# Altium project sommotor.PrjPcb (part 2 of 2)

## Sheet 3 - Motor Drivers.SchDoc
size Tabloid
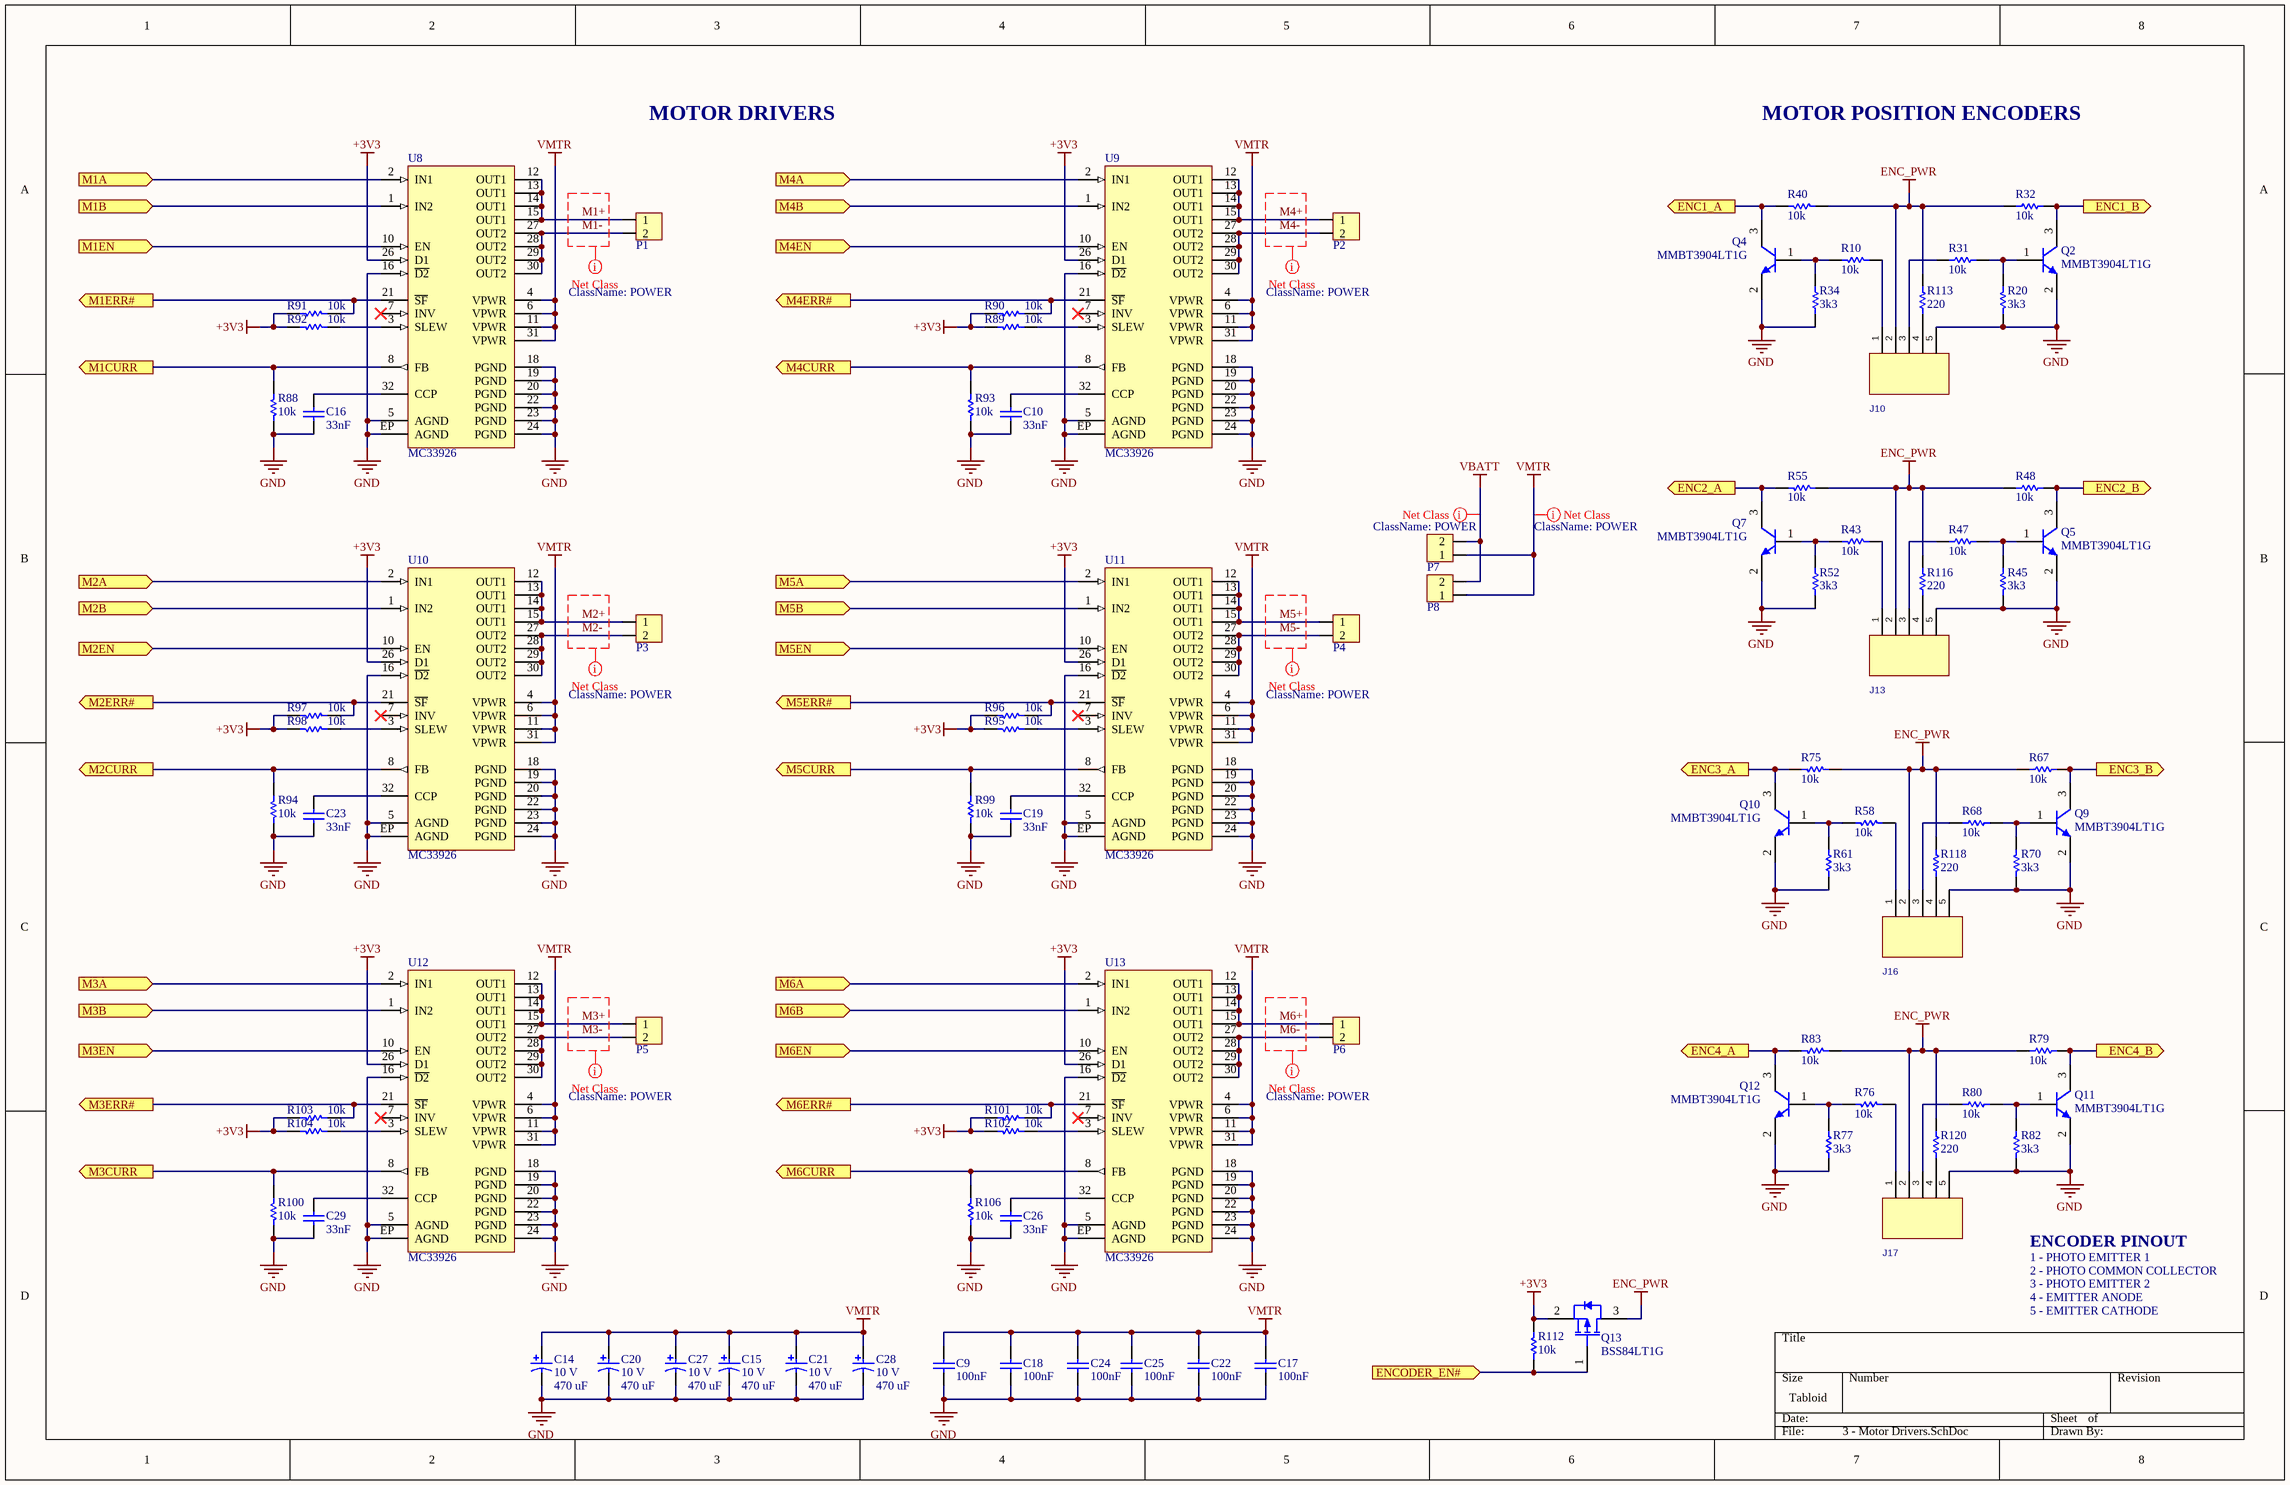
[diagram p3: 3 - Motor Drivers.SchDoc]

### Parts
C9  value 100nF  [CAPC0805(2012)100_L]  (hidden comment: CAP 100nF 6.3V 0805(2012))
C10  value 33nF  [CAPC0805(2012)100_L]  (hidden comment: CAP 33nF 50V 0805(2012))
C14  Rated Voltage: 10 V  Rated Capacitance: 470 uF  [NIC-CAPA2-8X10_V]  (hidden comment: UUD1A471MNL1GS)
C15  Rated Voltage: 10 V  Rated Capacitance: 470 uF  [NIC-CAPA2-8X10_V]  (hidden comment: UUD1A471MNL1GS)
C16  value 33nF  [CAPC0805(2012)100_L]  (hidden comment: CAP 33nF 50V 0805(2012))
C17  value 100nF  [CAPC0805(2012)100_L]  (hidden comment: CAP 100nF 6.3V 0805(2012))
C18  value 100nF  [CAPC0805(2012)100_L]  (hidden comment: CAP 100nF 6.3V 0805(2012))
C19  value 33nF  [CAPC0805(2012)100_L]  (hidden comment: CAP 33nF 50V 0805(2012))
C20  Rated Voltage: 10 V  Rated Capacitance: 470 uF  [NIC-CAPA2-8X10_V]  (hidden comment: UUD1A471MNL1GS)
C21  Rated Voltage: 10 V  Rated Capacitance: 470 uF  [NIC-CAPA2-8X10_V]  (hidden comment: UUD1A471MNL1GS)
C22  value 100nF  [CAPC0805(2012)100_L]  (hidden comment: CAP 100nF 6.3V 0805(2012))
C23  value 33nF  [CAPC0805(2012)100_L]  (hidden comment: CAP 33nF 50V 0805(2012))
C24  value 100nF  [CAPC0805(2012)100_L]  (hidden comment: CAP 100nF 6.3V 0805(2012))
C25  value 100nF  [CAPC0805(2012)100_L]  (hidden comment: CAP 100nF 6.3V 0805(2012))
C26  value 33nF  [CAPC0805(2012)100_L]  (hidden comment: CAP 33nF 50V 0805(2012))
C27  Rated Voltage: 10 V  Rated Capacitance: 470 uF  [NIC-CAPA2-8X10_V]  (hidden comment: UUD1A471MNL1GS)
C28  Rated Voltage: 10 V  Rated Capacitance: 470 uF  [NIC-CAPA2-8X10_V]  (hidden comment: UUD1A471MNL1GS)
C29  value 33nF  [CAPC0805(2012)100_L]  (hidden comment: CAP 33nF 50V 0805(2012))
J10  DF13-5P-1.25DS(20)  [HRS_DF13-5P-1.25DS(20)]  (value not drawn)
J13  DF13-5P-1.25DS(20)  [HRS_DF13-5P-1.25DS(20)]  (value not drawn)
J16  DF13-5P-1.25DS(20)  [HRS_DF13-5P-1.25DS(20)]  (value not drawn)
J17  DF13-5P-1.25DS(20)  [HRS_DF13-5P-1.25DS(20)]  (value not drawn)
P1  HDR1x2_2.54  [HDR1X2_2.54_180]  (value not drawn)
P2  HDR1x2_2.54  [HDR1X2_2.54_180]  (value not drawn)
P3  HDR1x2_2.54  [HDR1X2_2.54_180]  (value not drawn)
P4  HDR1x2_2.54  [HDR1X2_2.54_180]  (value not drawn)
P5  HDR1x2_2.54  [HDR1X2_2.54_180]  (value not drawn)
P6  HDR1x2_2.54  [HDR1X2_2.54_180]  (value not drawn)
P7  HDR1x2_2.54  [HDR1X2_2.54_180]  (value not drawn)
P8  HDR1x2_2.54  [HDR1X2_2.54_180]  (value not drawn)
Q2  MMBT3904LT1G  [ONSC-SOT-23-3-318-08_V]
Q4  MMBT3904LT1G  [ONSC-SOT-23-3-318-08_V]
Q5  MMBT3904LT1G  [ONSC-SOT-23-3-318-08_V]
Q7  MMBT3904LT1G  [ONSC-SOT-23-3-318-08_V]
Q9  MMBT3904LT1G  [ONSC-SOT-23-3-318-08_V]
Q10  MMBT3904LT1G  [ONSC-SOT-23-3-318-08_V]
Q11  MMBT3904LT1G  [ONSC-SOT-23-3-318-08_V]
Q12  MMBT3904LT1G  [ONSC-SOT-23-3-318-08_V]
Q13  BSS84LT1G  [ONSC-SOT-23-3-318-08_V]
R10  value 10k  [RESC0805(2012)_L]  (hidden comment: 10K 1% 0805(2012))
R20  value 3k3  [RESC0805(2012)_L]  (hidden comment: 3K3 1% 0805(2012))
R31  value 10k  [RESC0805(2012)_L]  (hidden comment: 10K 1% 0805(2012))
R32  value 10k  [RESC0805(2012)_L]  (hidden comment: 10K 1% 0805(2012))
R34  value 3k3  [RESC0805(2012)_L]  (hidden comment: 3K3 1% 0805(2012))
R40  value 10k  [RESC0805(2012)_L]  (hidden comment: 10K 1% 0805(2012))
R43  value 10k  [RESC0805(2012)_L]  (hidden comment: 10K 1% 0805(2012))
R45  value 3k3  [RESC0805(2012)_L]  (hidden comment: 3K3 1% 0805(2012))
R47  value 10k  [RESC0805(2012)_L]  (hidden comment: 10K 1% 0805(2012))
R48  value 10k  [RESC0805(2012)_L]  (hidden comment: 10K 1% 0805(2012))
R52  value 3k3  [RESC0805(2012)_L]  (hidden comment: 3K3 1% 0805(2012))
R55  value 10k  [RESC0805(2012)_L]  (hidden comment: 10K 1% 0805(2012))
R58  value 10k  [RESC0805(2012)_L]  (hidden comment: 10K 1% 0805(2012))
R61  value 3k3  [RESC0805(2012)_L]  (hidden comment: 3K3 1% 0805(2012))
R67  value 10k  [RESC0805(2012)_L]  (hidden comment: 10K 1% 0805(2012))
R68  value 10k  [RESC0805(2012)_L]  (hidden comment: 10K 1% 0805(2012))
R70  value 3k3  [RESC0805(2012)_L]  (hidden comment: 3K3 1% 0805(2012))
R75  value 10k  [RESC0805(2012)_L]  (hidden comment: 10K 1% 0805(2012))
R76  value 10k  [RESC0805(2012)_L]  (hidden comment: 10K 1% 0805(2012))
R77  value 3k3  [RESC0805(2012)_L]  (hidden comment: 3K3 1% 0805(2012))
R79  value 10k  [RESC0805(2012)_L]  (hidden comment: 10K 1% 0805(2012))
R80  value 10k  [RESC0805(2012)_L]  (hidden comment: 10K 1% 0805(2012))
R82  value 3k3  [RESC0805(2012)_L]  (hidden comment: 3K3 1% 0805(2012))
R83  value 10k  [RESC0805(2012)_L]  (hidden comment: 10K 1% 0805(2012))
R88  value 10k  [RESC0805(2012)_L]  (hidden comment: 10K 1% 0805(2012))
R89  value 10k  [RESC0805(2012)_L]  (hidden comment: 10K 1% 0805(2012))
R90  value 10k  [RESC0805(2012)_L]  (hidden comment: 10K 1% 0805(2012))
R91  value 10k  [RESC0805(2012)_L]  (hidden comment: 10K 1% 0805(2012))
R92  value 10k  [RESC0805(2012)_L]  (hidden comment: 10K 1% 0805(2012))
R93  value 10k  [RESC0805(2012)_L]  (hidden comment: 10K 1% 0805(2012))
R94  value 10k  [RESC0805(2012)_L]  (hidden comment: 10K 1% 0805(2012))
R95  value 10k  [RESC0805(2012)_L]  (hidden comment: 10K 1% 0805(2012))
R96  value 10k  [RESC0805(2012)_L]  (hidden comment: 10K 1% 0805(2012))
R97  value 10k  [RESC0805(2012)_L]  (hidden comment: 10K 1% 0805(2012))
R98  value 10k  [RESC0805(2012)_L]  (hidden comment: 10K 1% 0805(2012))
R99  value 10k  [RESC0805(2012)_L]  (hidden comment: 10K 1% 0805(2012))
R100  value 10k  [RESC0805(2012)_L]  (hidden comment: 10K 1% 0805(2012))
R101  value 10k  [RESC0805(2012)_L]  (hidden comment: 10K 1% 0805(2012))
R102  value 10k  [RESC0805(2012)_L]  (hidden comment: 10K 1% 0805(2012))
R103  value 10k  [RESC0805(2012)_L]  (hidden comment: 10K 1% 0805(2012))
R104  value 10k  [RESC0805(2012)_L]  (hidden comment: 10K 1% 0805(2012))
R106  value 10k  [RESC0805(2012)_L]  (hidden comment: 10K 1% 0805(2012))
R112  value 10k  [RESC0805(2012)_L]  (hidden comment: 10K 1% 0805(2012))
R113  value 220  [RESC0805(2012)_L]  (hidden comment: 220R 1% 0805(2012))
R116  value 220  [RESC0805(2012)_L]  (hidden comment: 220R 1% 0805(2012))
R118  value 220  [RESC0805(2012)_L]  (hidden comment: 220R 1% 0805(2012))
R120  value 220  [RESC0805(2012)_L]  (hidden comment: 220R 1% 0805(2012))
U8  MC33926  [FREESCALE_32PQFN]
U9  MC33926  [FREESCALE_32PQFN]
U10  MC33926  [FREESCALE_32PQFN]
U11  MC33926  [FREESCALE_32PQFN]
U12  MC33926  [FREESCALE_32PQFN]
U13  MC33926  [FREESCALE_32PQFN]

### Ports
ENC1_A (out), ENC1_B (out), ENC2_A (out), ENC2_B (out), ENC3_A (out), ENC3_B (out), ENC4_A (out), ENC4_B (out), ENCODER_EN# (in), M1A (in), M1B (in), M1CURR (out), M1EN (in), M1ERR# (out), M2A (in), M2B (in), M2CURR (out), M2EN (in), M2ERR# (out), M3A (in), M3B (in), M3CURR (out), M3EN (in), M3ERR# (out), M4A (in), M4B (in), M4CURR (out), M4EN (in), M4ERR# (out), M5A (in), M5B (in), M5CURR (out), M5EN (in), M5ERR# (out), M6A (in), M6B (in), M6CURR (out), M6EN (in), M6ERR# (out)

### Nets
+3V3: Q13.2(S) R89.2 R90.2 R91.2 R92.2 R95.2 R96.2 R97.2 R98.2 R101.2 R102.2 R103.2 R104.2 R112.1 U8.26(D1) U9.26(D1) U10.26(D1) U11.26(D1) U12.26(D1) U13.26(D1)
ENC_PWR: J10.2 J13.2 J16.2 J17.2 Q13.3(D) R32.1 R40.2 R48.1 R55.2 R67.1 R75.2 R79.1 R83.2 R113.2 R116.2 R118.2 R120.2
GND: C9.1 C10.1 C14.2 C15.2 C16.1 C17.1 C18.1 C19.1 C20.2 C21.2 C22.1 C23.1 C24.1 C25.1 C26.1 C27.2 C28.2 C29.1 J10.5 J13.5 J16.5 J17.5 Q2.2(E) Q4.2(E) Q5.2(E) Q7.2(E) Q9.2(E) Q10.2(E) Q11.2(E) Q12.2(E) R20.2 R34.2 R45.2 R52.2 R61.2 R70.2 R77.2 R82.2 R88.1 R93.1 R94.1 R99.1 R100.1 R106.1 U8.5(AGND) U8.16(~{D2}) U8.18(PGND) U8.19(PGND) U8.20(PGND) U8.22(PGND) U8.23(PGND) U8.24(PGND) U8.EP(AGND) U9.5(AGND) U9.16(~{D2}) U9.18(PGND) U9.19(PGND) U9.20(PGND) U9.22(PGND) U9.23(PGND) U9.24(PGND) U9.EP(AGND) U10.5(AGND) U10.16(~{D2}) U10.18(PGND) U10.19(PGND) U10.20(PGND) U10.22(PGND) U10.23(PGND) U10.24(PGND) U10.EP(AGND) U11.5(AGND) U11.16(~{D2}) U11.18(PGND) U11.19(PGND) U11.20(PGND) U11.22(PGND) U11.23(PGND) U11.24(PGND) U11.EP(AGND) U12.5(AGND) U12.16(~{D2}) U12.18(PGND) U12.19(PGND) U12.20(PGND) U12.22(PGND) U12.23(PGND) U12.24(PGND) U12.EP(AGND) U13.5(AGND) U13.16(~{D2}) U13.18(PGND) U13.19(PGND) U13.20(PGND) U13.22(PGND) U13.23(PGND) U13.24(PGND) U13.EP(AGND)
VBATT: P7.2 P8.2
VMTR: C9.2 C14.1 C15.1 C17.2 C18.2 C20.1 C21.1 C22.2 C24.2 C25.2 C27.1 C28.1 P7.1 P8.1 U8.4(VPWR) U8.6(VPWR) U8.11(VPWR) U8.31(VPWR) U9.4(VPWR) U9.6(VPWR) U9.11(VPWR) U9.31(VPWR) U10.4(VPWR) U10.6(VPWR) U10.11(VPWR) U10.31(VPWR) U11.4(VPWR) U11.6(VPWR) U11.11(VPWR) U11.31(VPWR) U12.4(VPWR) U12.6(VPWR) U12.11(VPWR) U12.31(VPWR) U13.4(VPWR) U13.6(VPWR) U13.11(VPWR) U13.31(VPWR)
M1+: P1.1 U8.12(OUT1) U8.13(OUT1) U8.14(OUT1) U8.15(OUT1)
M1-: P1.2 U8.27(OUT2) U8.28(OUT2) U8.29(OUT2) U8.30(OUT2)
M2+: P3.1 U10.12(OUT1) U10.13(OUT1) U10.14(OUT1) U10.15(OUT1)
M2-: P3.2 U10.27(OUT2) U10.28(OUT2) U10.29(OUT2) U10.30(OUT2)
M3+: P5.1 U12.12(OUT1) U12.13(OUT1) U12.14(OUT1) U12.15(OUT1)
M3-: P5.2 U12.27(OUT2) U12.28(OUT2) U12.29(OUT2) U12.30(OUT2)
M4+: P2.1 U9.12(OUT1) U9.13(OUT1) U9.14(OUT1) U9.15(OUT1)
M4-: P2.2 U9.27(OUT2) U9.28(OUT2) U9.29(OUT2) U9.30(OUT2)
M5+: P4.1 U11.12(OUT1) U11.13(OUT1) U11.14(OUT1) U11.15(OUT1)
M5-: P4.2 U11.27(OUT2) U11.28(OUT2) U11.29(OUT2) U11.30(OUT2)
M6+: P6.1 U13.12(OUT1) U13.13(OUT1) U13.14(OUT1) U13.15(OUT1)
M6-: P6.2 U13.27(OUT2) U13.28(OUT2) U13.29(OUT2) U13.30(OUT2)
NetC10_2: C10.2 U9.32(CCP)
NetC16_2: C16.2 U8.32(CCP)
NetC19_2: C19.2 U11.32(CCP)
NetC23_2: C23.2 U10.32(CCP)
NetC26_2: C26.2 U13.32(CCP)
NetC29_2: C29.2 U12.32(CCP)
NetJ10_1: J10.1 R10.1
NetJ10_3: J10.3 R31.1
NetJ10_4: J10.4 R113.1
NetJ13_1: J13.1 R43.1
NetJ13_3: J13.3 R47.1
NetJ13_4: J13.4 R116.1
NetJ16_1: J16.1 R58.1
NetJ16_3: J16.3 R68.1
NetJ16_4: J16.4 R118.1
NetJ17_1: J17.1 R76.1
NetJ17_3: J17.3 R80.1
NetJ17_4: J17.4 R120.1
NetQ2_1: Q2.1(B) R20.1 R31.2
NetQ2_3: Q2.3(C) R32.2 ; port ENC1_B
NetQ4_1: Q4.1(B) R10.2 R34.1
NetQ4_3: Q4.3(C) R40.1 ; port ENC1_A
NetQ5_1: Q5.1(B) R45.1 R47.2
NetQ5_3: Q5.3(C) R48.2 ; port ENC2_B
NetQ7_1: Q7.1(B) R43.2 R52.1
NetQ7_3: Q7.3(C) R55.1 ; port ENC2_A
NetQ9_1: Q9.1(B) R68.2 R70.1
NetQ9_3: Q9.3(C) R67.2 ; port ENC3_B
NetQ10_1: Q10.1(B) R58.2 R61.1
NetQ10_3: Q10.3(C) R75.1 ; port ENC3_A
NetQ11_1: Q11.1(B) R80.2 R82.1
NetQ11_3: Q11.3(C) R79.2 ; port ENC4_B
NetQ12_1: Q12.1(B) R76.2 R77.1
NetQ12_3: Q12.3(C) R83.1 ; port ENC4_A
NetQ13_1: Q13.1(G) R112.2 ; port ENCODER_EN#
NetR88_2: R88.2 U8.8(FB) ; port M1CURR
NetR89_1: R89.1 U9.3(SLEW)
NetR90_1: R90.1 U9.21(~{SF}) ; port M4ERR#
NetR91_1: R91.1 U8.21(~{SF}) ; port M1ERR#
NetR92_1: R92.1 U8.3(SLEW)
NetR93_2: R93.2 U9.8(FB) ; port M4CURR
NetR94_2: R94.2 U10.8(FB) ; port M2CURR
NetR95_1: R95.1 U11.3(SLEW)
NetR96_1: R96.1 U11.21(~{SF}) ; port M5ERR#
NetR97_1: R97.1 U10.21(~{SF}) ; port M2ERR#
NetR98_1: R98.1 U10.3(SLEW)
NetR99_2: R99.2 U11.8(FB) ; port M5CURR
NetR100_2: R100.2 U12.8(FB) ; port M3CURR
NetR101_1: R101.1 U13.21(~{SF}) ; port M6ERR#
NetR102_1: R102.1 U13.3(SLEW)
NetR103_1: R103.1 U12.21(~{SF}) ; port M3ERR#
NetR104_1: R104.1 U12.3(SLEW)
NetR106_2: R106.2 U13.8(FB) ; port M6CURR
NetU1#1_7: U8.10(EN) ; port M1EN
NetU1#1_8: U10.10(EN) ; port M2EN
NetU1#1_9: U12.10(EN) ; port M3EN
NetU1#1_63: U13.10(EN) ; port M6EN
NetU1#1_64: U11.10(EN) ; port M5EN
NetU1#1_65: U9.10(EN) ; port M4EN
NetU5_3: U10.2(IN1) ; port M2A
NetU5_6: U10.1(IN2) ; port M2B
NetU5_8: U8.1(IN2) ; port M1B
NetU5_11: U8.2(IN1) ; port M1A
NetU6_3: U13.2(IN1) ; port M6A
NetU6_6: U13.1(IN2) ; port M6B
NetU6_8: U12.1(IN2) ; port M3B
NetU6_11: U12.2(IN1) ; port M3A
NetU7_3: U9.2(IN1) ; port M4A
NetU7_6: U9.1(IN2) ; port M4B
NetU7_8: U11.1(IN2) ; port M5B
NetU7_11: U11.2(IN1) ; port M5A

Not connected (* = marked no-connect by the designer): U8 7(INV)*; U9 7(INV)*; U10 7(INV)*; U11 7(INV)*; U12 7(INV)*; U13 7(INV)*

### Layout directives
net class POWER: M1+, M1-, M2+, M2-, M3+, M3-, M4+, M4-, M5+, M5-, M6+, M6-, VBATT, VMTR

### Notes on the sheet
- MOTOR DRIVERS
- MOTOR POSITION ENCODERS
- ENCODER PINOUT
- 1 - PHOTO EMITTER 1
- 2 - PHOTO COMMON COLLECTOR
- 3 - PHOTO EMITTER 2
- 4 - EMITTER ANODE
- 5 - EMITTER CATHODE

### Library data of the parts
C9 C17 C18 C22 C24 C25 = CMP-1036-04391-1: CAP 100nF 6.3V Â±10% 0805 (2012 Metric) Thickness 1mm SMD; Case-EIA: 0805; Case-Metric: 2012; Rated Voltage: 6.3 V; Technology: SMT; Tolerance: Â±10%; Max Thickness: 1 mm
C10 C16 C19 C23 C26 C29 = CMP-1036-04174-1: CAP 33nF 50V -20% to +80% 0805 (2012 Metric) Thickness 1mm SMD; Case-Metric: 2012; Case-EIA: 0805; Tolerance: -20% to +80%; Technology: SMT; Max Thickness: 1 mm; Rated Voltage: 50 V
C14 C15 C20 C21 C27 C28 = CMP-0687-00070-1: Aluminum Electrolytic Capacitor, UD Series, Low Impedance, 470 uF, 10 V, + / - 20%, -55 to 105 degC, Chip Type, 8 x 10 mm D x L, Pb-Free, Reel; Manufacturer: Nichicon; Endurance Time: 5000 h; Tolerance Rated Capacitance: -20 to 20%; Packing: Dia382mm Reel; Rated Ripple Current (at 100kHz): 450 mA; Impedance: 0.17 Ohm; ComponentLink1Description: Manufacturer URL; DatasheetVersion: 08/2012; ComponentLink1URL: http://www.nichicon.co.jp/; Mounting Technology: Surface Mount; ComponentLink2URL: http://products.nichicon.co.jp/en/pdf/XJA043/e-ud.pdf; Length: 10 mm; PackageDescription: 2-Pin Surface Mount Device, Diameter 8 mm, Height 10 mm, Pitch 6.5 mm; RoHS: TRUE; PartNumber: UUD1A471MNL1GS; Diameter: 8 mm; ComponentLink3URL: http://products.nichicon.co.jp/en/pdf/XJA043/e-ud.pdf; ComponentLink3Description: Package Specification; ComponentLink2Description: Datasheet; PackageReference: CAPAE-D8H10
J10 J13 J16 J17 = CON_HRS_DF13-5P-1.25DS(20): CONN HEADER 5POS 1.25MM R/A THT TIN; Manufacturer: Hirose Electric Co Ltd; Connector Type: Header, Shrouded; Number of Positions: 5; Number of Positions Loaded: All; Pitch: 0.049" (1.25mm); Supplier 1: Digi-Key; Manufacturer Part Number: DF13-5P-1.25DS(20); RoHS: RoHS Compliant; Category: Connectors, Interconnects; Stock 1: 10851; Pricing 1: 1=0.61, 10=0.57, 50=0.456, 100=0.437, 250=0.399, 500=0.38, 1000=0.3135, 2500=0.285, 5000=0.2755 (USD); Packaging: Tube; Contact Type: Male Pin; Number of Rows: 1; Row Spacing: -; Contact Mating Length: -; Mounting Type: Through Hole, Right Angle; Termination: Solder; Fastening Type: -; Features: Board Guide; Contact Finish: Tin; Contact Finish Thickness: -; Color: Beige; ComponentLink1URL: http://www.hirose.co.jp/cataloge_hp/2d/EDC3-081818-01.pdf; ComponentLink1Description: http://www.hirose.co.jp/cataloge_hp/2d/EDC3-081818-01.pdf; Supplier Part Number 1: H2202-ND
P1-P8 = HDR1x2_2.54: Header
Q2 Q4 Q5 Q7 Q9-Q12 = CMP-1048-00631-1: General Purpose Transistor, NPN Silicon, 3-Pin SOT-23, Pb-Free, Tape and Reel; Manufacturer: On Semiconductor; IC Continuous (A): 0.2; fT Min (MHz): 300; ComponentLink2Description: Datasheet; Polarity: NPN; PackageDescription: 3-Pin Small Outline Transistor, Body 2.92 x 1.3 mm, Pitch 0.95 mm; ComponentLink2URL: http://www.onsemi.cn/pub_link/Collateral/MMBT3904LT1-D.PDF; DatasheetVersion: Rev. 12; Mounting Technology: Surface Mount; PartNumber: MMBT3904LT1G; ComponentLink1URL: http://www.onsemi.com/; ComponentLink3Description: Package Specification; ComponentLink1Description: Manufacturer URL; PackageVersion: Rev. AP, 11/2009; PackageReference: SOT-23-3-318-08; Packing: Tape and Reel; ComponentLink3URL: http://www.onsemi.cn/pub_link/Collateral/318-08.PDF; RoHS: TRUE
Q13 = CMP-1058-00762-1: Power MOSFET Single P-Channel, -50 V, 10 Ohm, 3-Pin SOT-23, Pb-Free, Tape and Reel; Manufacturer: On Semiconductor; Ciss Typ (pF): 36; ID Max (A): 0.13; Channel Polarity: P Channel; VGS(th) Max (V): 2; VGS Max (V): 20; V(BR)DSS Min (V): 50; Crss Typ (pF): 6.5; PD Max (W): 0.225; Coss Typ (pF): 17; Configuration: Single; Mounting Technology: Surface Mount; ComponentLink3URL: http://www.onsemi.cn/pub_link/Collateral/318-08.PDF; ComponentLink1Description: Manufacturer URL; Package Type: SOT-23-3; ComponentLink2URL: http://www.onsemi.com/pub_link/Collateral/BSS84LT1-D.PDF; RoHS: Pb-Free; Packing: Tape and Reel; ComponentLink1URL: http://www.onsemi.com/; PackageVersion: Rev. AP, 11/2009; PackageReference: SOT-23-3-318-08; PackageDescription: 3-Pin Small Outline Transistor, Body 2.92 x 1.3 mm, Pitch 0.95 mm; DatasheetVersion: Rev. 8; ComponentLink3Description: Package Specification; PartNumber: BSS84LT1G; ComponentLink2Description: Datasheet
R10 R31 R32 R40 R43 R47 R48 R55 R58 R67 R68 R75 R76 R79 R80 R83 R88-R104 R106 R112 = CMP-1013-00623-1: 10K 0.125W 1% 0805 (2012 Metric)  SMD; Case-Metric: 2012; Case-EIA: 0805; Tolerance: 1 %; Power: 0.125 W; Technology: SMT
R20 R34 R45 R52 R61 R70 R77 R82 = CMP-1013-00567-1: 3K3 0.125W 1% 0805 (2012 Metric)  SMD; Case-Metric: 2012; Case-EIA: 0805; Technology: SMT; Tolerance: 1 %; Power: 0.125 W
R113 R116 R118 R120 = CMP-1013-00433-1: 220R 0.125W 1% 0805 (2012 Metric)  SMD; Case-EIA: 0805; Case-Metric: 2012; Technology: SMT; Tolerance: 1 %; Power: 0.125 W
U8-U13 = MC33926: 5A Throttle Control H-Bridge

## Sheet 4 - Connectors.SchDoc
size Tabloid
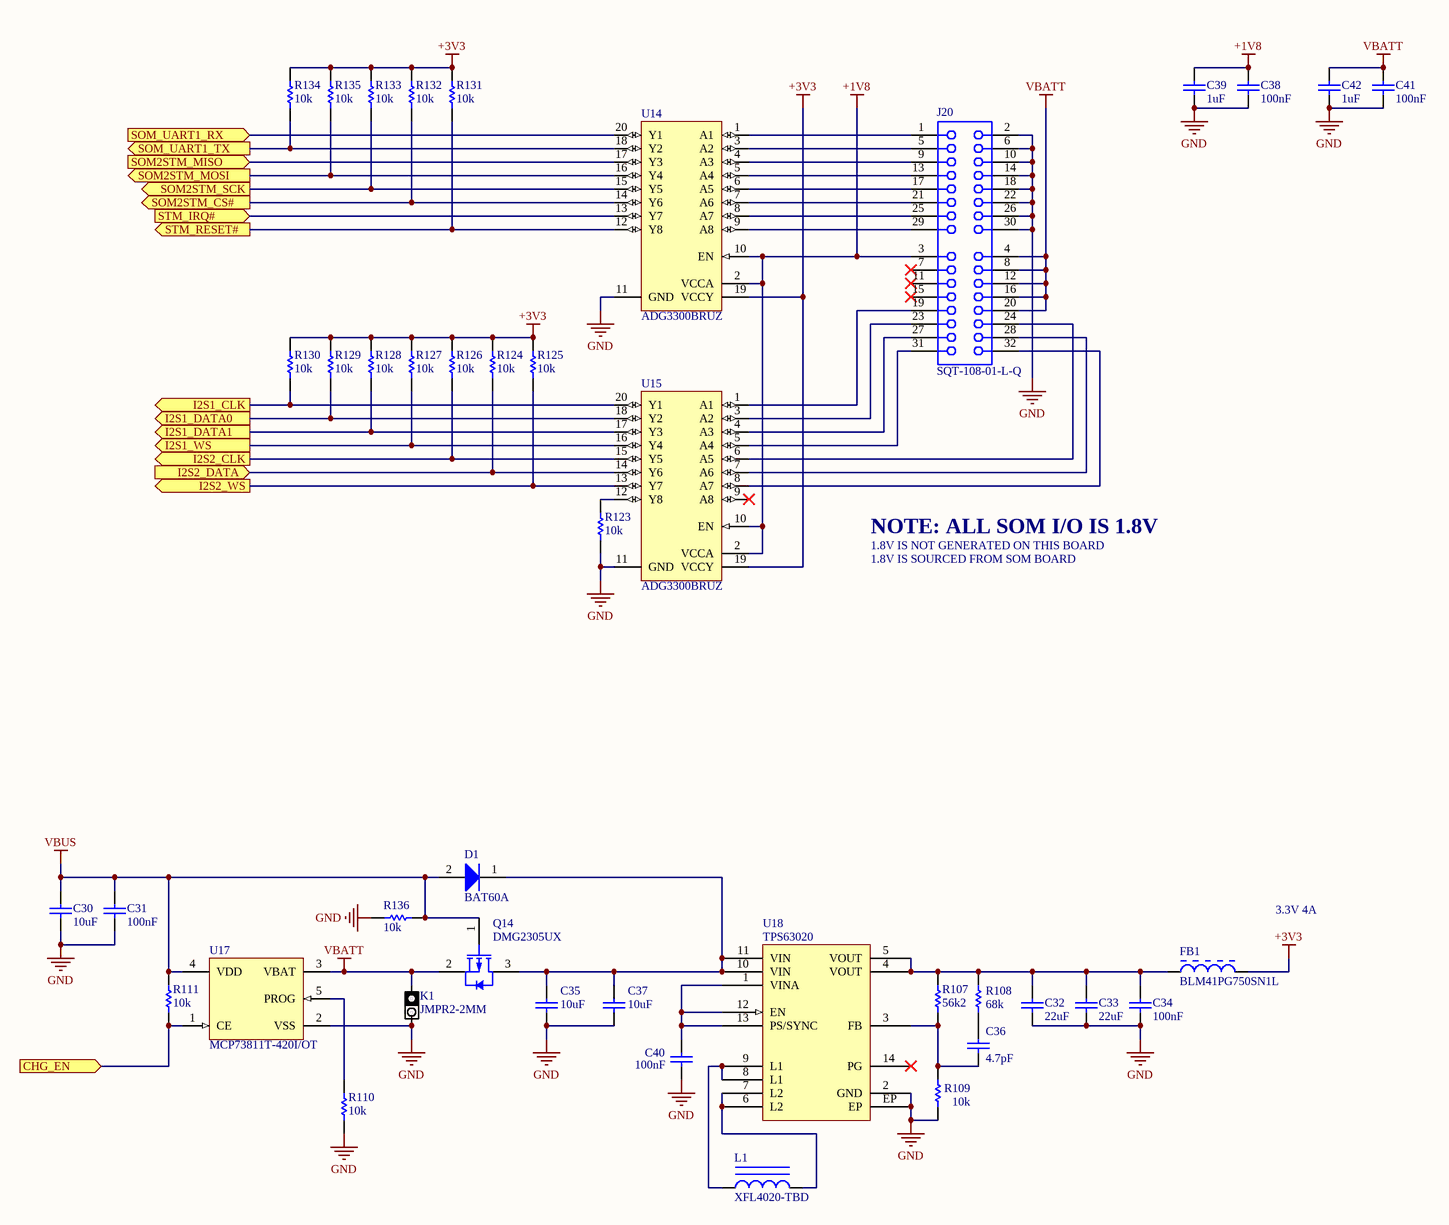
[diagram p4: 4 - Connectors.SchDoc]

### Parts
C30  value 10uF  [CAPC0805(2012)100_L]  (hidden comment: CAP 10uF 6.3V 0805(2012))
C31  value 100nF  [CAPC0805(2012)100_L]  (hidden comment: CAP 100nF 6.3V 0805(2012))
C32  value 22uF  [CAPC0805(2012)145_L]  (hidden comment: CAP 22uF 16V 0805(2012))
C33  value 22uF  [CAPC0805(2012)145_L]  (hidden comment: CAP 22uF 16V 0805(2012))
C34  value 100nF  [CAPC0805(2012)100_L]  (hidden comment: CAP 100nF 25V 0805(2012))
C35  value 10uF  [CAPC0805(2012)100_L]  (hidden comment: CAP 10uF 6.3V 0805(2012))
C36  value 4.7pF  [CAPC0805(2012)100_L]  (hidden comment: CAP 4.7pF 10V 0805(2012))
C37  value 10uF  [CAPC0805(2012)100_L]  (hidden comment: CAP 10uF 6.3V 0805(2012))
C38  value 100nF  [CAPC0805(2012)100_L]  (hidden comment: CAP 100nF 6.3V 0805(2012))
C39  value 1uF  [CAPC0805(2012)100_L]  (hidden comment: CAP 1uF 6.3V 0805(2012))
C40  value 100nF  [CAPC0805(2012)100_L]  (hidden comment: CAP 100nF 6.3V 0805(2012))
C41  value 100nF  [CAPC0805(2012)100_L]  (hidden comment: CAP 100nF 6.3V 0805(2012))
C42  value 1uF  [CAPC0805(2012)100_L]  (hidden comment: CAP 1uF 6.3V 0805(2012))
D1  BAT60A  [INF-SOD323_V]
FB1  BLM41PG750SN1L  [MURA-BLM41-B35-CHIP-2_V2]
J20  SQT-108-01-L-Q  [SMTC-SQT-108-01-X-Q]
K1  JMPR2-2MM  [JMPR2-2MM]
L1  XFL4020-TBD  [COILCRAFT_XFL4020]
Q14  DMG2305UX  [ONSC-SOT-23-3-318-08_V]
R107  value 56k2  [RESC0805(2012)_L]
R108  value 68k  [RESC0805(2012)_L]  (hidden comment: 68K 5% 0805(2012))
R109  value 10k  [RESC0805(2012)_L]  (hidden comment: 10K 1% 0805(2012))
R110  value 10k  [RESC0805(2012)_L]  (hidden comment: 10K 1% 0805(2012))
R111  value 10k  [RESC0805(2012)_L]  (hidden comment: 10K 1% 0805(2012))
R123  value 10k  [RESC0805(2012)_L]  (hidden comment: 10K 1% 0805(2012))
R124  value 10k  [RESC0805(2012)_L]  (hidden comment: 10K 1% 0805(2012))
R125  value 10k  [RESC0805(2012)_L]  (hidden comment: 10K 1% 0805(2012))
R126  value 10k  [RESC0805(2012)_L]  (hidden comment: 10K 1% 0805(2012))
R127  value 10k  [RESC0805(2012)_L]  (hidden comment: 10K 1% 0805(2012))
R128  value 10k  [RESC0805(2012)_L]  (hidden comment: 10K 1% 0805(2012))
R129  value 10k  [RESC0805(2012)_L]  (hidden comment: 10K 1% 0805(2012))
R130  value 10k  [RESC0805(2012)_L]  (hidden comment: 10K 1% 0805(2012))
R131  value 10k  [RESC0805(2012)_L]  (hidden comment: 10K 1% 0805(2012))
R132  value 10k  [RESC0805(2012)_L]  (hidden comment: 10K 1% 0805(2012))
R133  value 10k  [RESC0805(2012)_L]  (hidden comment: 10K 1% 0805(2012))
R134  value 10k  [RESC0805(2012)_L]  (hidden comment: 10K 1% 0805(2012))
R135  value 10k  [RESC0805(2012)_L]  (hidden comment: 10K 1% 0805(2012))
R136  value 10k  [RESC0805(2012)_L]  (hidden comment: 10K 1% 0805(2012))
U14  ADG3300BRUZ  [ADI-RU-20_N]
U15  ADG3300BRUZ  [ADI-RU-20_N]
U17  MCP73811T-420I/OT  [SOT-23-OT5_M]
U18  TPS63020  [VSON14]

### Ports
CHG_EN (in), I2S1_CLK (out), I2S1_DATA0 (out), I2S1_DATA1 (out), I2S1_WS (out), I2S2_CLK (out), I2S2_DATA (in), I2S2_WS (out), SOM2STM_CS# (out), SOM2STM_MISO (in), SOM2STM_MOSI (out), SOM2STM_SCK (out), SOM_UART1_RX (in), SOM_UART1_TX (out), STM_IRQ# (in), STM_RESET# (out)

### Nets
+1V8: C38.2 C39.2 J20.3 U14.2(VCCA) U14.10(EN) U15.2(VCCA) U15.10(EN)
+3V3: FB1.2 R124.1 R125.1 R126.1 R127.1 R128.1 R129.1 R130.1 R131.1 R132.1 R133.1 R134.1 R135.1 U14.19(VCCY) U15.19(VCCY)
GND: C30.1 C31.2 C32.1 C33.1 C34.1 C35.1 C37.1 C38.1 C39.1 C40.2 C41.1 C42.1 J20.2 J20.6 J20.10 J20.14 J20.18 J20.22 J20.26 J20.30 K1.2 R109.1 R110.1 R123.2 R136.2 U14.11(GND) U15.11(GND) U17.2(VSS) U18.2(GND) U18.EP
VBATT: C41.2 C42.2 J20.4 J20.8 J20.12 J20.16 J20.20 K1.1 Q14.2(S) U17.3(VBAT)
VBUS: C30.2 C31.1 D1.2(A) Q14.1(G) R111.1 R136.1 U17.4(VDD)
I2S2_CLK: R130.2 U15.20(Y1) ; port I2S1_CLK
I2S2_SD: R128.2 U15.17(Y3) ; port I2S1_DATA1
I2S2_WS: R127.2 U15.16(Y4) ; port I2S1_WS
I2S3_CLK: R126.2 U15.15(Y5) ; port I2S2_CLK
I2S3_SD: R124.2 U15.14(Y6) ; port I2S2_DATA
RST#: R131.2 U14.12(Y8) ; port STM_RESET#
SPI2_CS#: R132.2 U14.14(Y6) ; port SOM2STM_CS#
SPI2_MISO: U14.17(Y3) ; port SOM2STM_MISO
SPI2_MOSI: R135.2 U14.16(Y4) ; port SOM2STM_MOSI
SPI2_SCK: R133.2 U14.15(Y5) ; port SOM2STM_SCK
NetC32_2: C32.2 C33.2 C34.2 FB1.1 R107.2 R108.2 U18.4(VOUT) U18.5(VOUT)
NetC35_2: C35.2 C37.2 D1.1(K) Q14.3(D) U18.10(VIN) U18.11(VIN)
NetC36_1: C36.1 R107.1 R109.2 U18.3(FB)
NetC36_2: C36.2 R108.1
NetC40_1: C40.1 U18.1(VINA) U18.12(EN) U18.13(PS/SYNC)
NetJ20_1: J20.1 U14.1(A1)
NetJ20_5: J20.5 U14.3(A2)
NetJ20_9: J20.9 U14.4(A3)
NetJ20_13: J20.13 U14.5(A4)
NetJ20_17: J20.17 U14.6(A5)
NetJ20_19: J20.19 U15.1(A1)
NetJ20_21: J20.21 U14.7(A6)
NetJ20_23: J20.23 U15.3(A2)
NetJ20_24: J20.24 U15.6(A5)
NetJ20_25: J20.25 U14.8(A7)
NetJ20_27: J20.27 U15.4(A3)
NetJ20_28: J20.28 U15.7(A6)
NetJ20_29: J20.29 U14.9(A8)
NetJ20_31: J20.31 U15.5(A4)
NetJ20_32: J20.32 U15.8(A7)
NetL1_1: L1.1 U18.8(L1) U18.9(L1)
NetL1_2: L1.2 U18.6(L2) U18.7(L2)
NetR38_2: R125.2 U15.13(Y7) ; port I2S2_WS
NetR49_2: R134.2 U14.18(Y2) ; port SOM_UART1_TX
NetR53_2: U14.20(Y1) ; port SOM_UART1_RX
NetR105_2: R129.2 U15.18(Y2) ; port I2S1_DATA0
NetR110_2: R110.2 U17.5(PROG)
NetR111_2: R111.2 U17.1(CE) ; port CHG_EN
NetR123_1: R123.1 U15.12(Y8)
NetU1#1_36: U14.13(Y7) ; port STM_IRQ#

Not connected (* = marked no-connect by the designer): J20 7* 11* 15*; U15 9(A8)*; U18 14(PG)*

### Notes on the sheet
- NOTE: ALL SOM I/O IS 1.8V
- 1.8V IS SOURCED FROM SOM BOARD
- 1.8V IS NOT GENERATED ON THIS BOARD
- 3.3V 4A

### Library data of the parts
C30 = CMP-1036-04917-1: CAP 10uF 6.3V Â±10% 0805 (2012 Metric) Thickness 1mm SMD; Case-EIA: 0805; Case-Metric: 2012; Max Thickness: 1 mm; Tolerance: Â±10%; Technology: SMT; Rated Voltage: 6.3 V
C31 C38 C40 C41 = CMP-1036-04391-1: as C9 on sheet 3 - Motor Drivers; Rated Voltage: 6.3 V; Technology: SMT; Tolerance: Â±10%; Max Thickness: 1 mm
C32 C33 = CMP-1036-04946-1: CAP 22uF 16V Â±20% 0805 (2012 Metric) Thickness 1.45mm SMD; Case-Metric: 2012; Case-EIA: 0805; Tolerance: Â±20%; Max Thickness: 1.45 mm; Rated Voltage: 16 V; Technology: SMT
C34 = CMP-1036-04411-1: CAP 100nF 25V Â±10% 0805 (2012 Metric) Thickness 1mm SMD; Case-EIA: 0805; Case-Metric: 2012; Max Thickness: 1 mm; Rated Voltage: 25 V; Technology: SMT; Tolerance: Â±10%
C35 C37 = CMP-1036-04920-1: CAP 10uF 6.3V Â±20% 0805 (2012 Metric) Thickness 1mm SMD; Case-Metric: 2012; Case-EIA: 0805; Max Thickness: 1 mm; Tolerance: Â±20%; Rated Voltage: 6.3 V; Technology: SMT
C36 = CMP-1036-00526-1: CAP 4.7pF 10V Â±0.25pF 0805 (2012 Metric) Thickness 1mm SMD; Case-Metric: 2012; Case-EIA: 0805; Tolerance: Â±0.25pF; Rated Voltage: 10 V; Max Thickness: 1 mm; Technology: SMT
C39 C42 = CMP-1036-04730-1: CAP 1uF 6.3V Â±5% 0805 (2012 Metric) Thickness 1mm SMD; Case-Metric: 2012; Case-EIA: 0805; Technology: SMT; Tolerance: Â±5%; Max Thickness: 1 mm; Rated Voltage: 6.3 V
D1 = CMP-1183-00008-2: Silicon Schottky Diode, -55 to 85 degC, SOD323, Reel, Green; Manufacturer: Infineon; Green: TRUE; VR (max): 10Â V; IF (max): 3,000Â mA; VF (max): 370Â mV; CT (max): 35Â pF; Configuration: Single; PackageDescription: 3-Pin Small Outline Transistor Package, 1.25 x 2 mm Body, 0.65 mm Pitch; PartNumber: BAT60A; Mounting Technology: Surface Mount; PackageReference: SOT323; ComponentLink1Description: Manufacturer URL; Packing: Reel; ComponentLink3URL: http://www.infineon.com/dgdl/SOT323-Package_Overview.pdf?folderId=db3a30431936bc4b0119533e1dcb3c92&fileId=db3a30431936bc4b011953495f283cb1; ComponentLink2URL: http://www.infineon.com/dgdl/bat60aseries.pdf?folderId=db3a304313d846880113def5812204a1&fileId=db3a304313d846880113def70c9304a9; ComponentLink1URL: http://www.infineon.com/; ComponentLink2Description: Datasheet; ComponentLink3Description: Package Specification
FB1 = CMP-0686-00749-2: Chip Ferrite Bead for Power Lines, 75 Ohm, 3500 mA, -55 to 125 degC, 4.5 x 1.6 x 1.8 mm SMD, Tape and Reel; Manufacturer: Murata; Rated Current: 3500 mA; Impedance (at 100 MHz): 75 Ohm Typ.; DC Resistance: 0.015 Ohm Max.; PackageReference: BLM41-2; Packing: Tape and Reel; PartNumber: BLM41PG750SN1L; ComponentLink1URL: http://www.murata.com/; ComponentLink3Description: Package Specification; ComponentLink1Description: Manufacturer URL; ComponentLink3URL: http://www.murata.com/products/catalog/pdf/c31e.pdf; DatasheetVersion: 08/2013; PackageDescription: 2-Pin Chip, Body 4.5 x 1.6 mm; Operating Temperature Range: -55 to 125 degC; Mounting Technology: Surface Mount; ComponentLink2URL: http://www.murata.com/products/catalog/pdf/c31e.pdf; ComponentLink2Description: Datasheet
J20 = CMP-1021-00092-1: Cost-Effective Rugged Socket, Through-hole, Vertical, -55 to 125 degC, 2 mm Pitch, 32-Pin, Female, RoHS; Manufacturer: Samtec; Pitch: 2 mm; Mounting Technology: Through-hole; ComponentLink3URL: http://www.samtec.com/documents/webfiles/cpdf/SQT-1XX-XX-XXX-X-XXX-XXX-MKT.pdf; ComponentLink1URL: http://www.samtec.com; RoHS: True; DatasheetVersion: F-214; ComponentLink1Description: Manufacturer URL; PartNumber: SQT-108-01-L-Q; PackageReference: SQT-108-01-X-Q; PackageDescription: 2mm Socket Strip Assembly; ComponentLink2URL: http://www.samtec.com/documents/webfiles/pdf/SQT_TH.PDF; Orientation: Vertical; ComponentLink3Description: Package Specification; PackageVersion: BY, 7/1995; ComponentLink2Description: Datasheet; Temperature Range: -55 to 125 degC
K1 = JMPR2-2MM: JMPR2 2MM OPEN BY DEFAULT; Manufacturer: Sullins Connector Solutions; Manufacturer Part Number: PBC36SAAN; Supplier 1: Digi-Key; Supplier Part Number 1: S1011E-36-ND; Reel: Open
L1 = SHIELDED_INDUCTOR
Q14 = CMP-1058-00762-1: Power MOSFET Single P-Channel, -50 V, 10 Ohm, 3-Pin SOT-23, Pb-Free, Tape and Reel; Manufacturer: On Semiconductor; PartNumber: BSS84LT1G; Ciss Typ (pF): 36; ID Max (A): 0.13; Channel Polarity: P Channel; VGS(th) Max (V): 2; VGS Max (V): 20; V(BR)DSS Min (V): 50; Crss Typ (pF): 6.5; PD Max (W): 0.225; Coss Typ (pF): 17; Configuration: Single; Mounting Technology: Surface Mount; ComponentLink3URL: http://www.onsemi.cn/pub_link/Collateral/318-08.PDF; ComponentLink1Description: Manufacturer URL; Package Type: SOT-23-3; ComponentLink2URL: http://www.onsemi.com/pub_link/Collateral/BSS84LT1-D.PDF; RoHS: Pb-Free; Packing: Tape and Reel; ComponentLink1URL: http://www.onsemi.com/; PackageVersion: Rev. AP, 11/2009; PackageReference: SOT-23-3-318-08; PackageDescription: 3-Pin Small Outline Transistor, Body 2.92 x 1.3 mm, Pitch 0.95 mm; DatasheetVersion: Rev. 8; ComponentLink3Description: Package Specification; ComponentLink2Description: Datasheet
R107 = CMP-1013-00645-1: 56k2 1% 0805(2012); Case-Metric: 2012; Case-EIA: 0805; Power: 0.125 W; Tolerance: 1 %; Technology: SMT
R108 = CMP-1013-00118-1: 68K 0.125W 5% 0805 (2012 Metric)  SMD; Case-EIA: 0805; Case-Metric: 2012; Technology: SMT; Power: 0.125 W; Tolerance: 5 %
R109 = CMP-1013-00645-1: 10K 0.125W 1% 0805 (2012 Metric)  SMD; Case-Metric: 2012; Case-EIA: 0805; Tolerance: 1 %; Technology: SMT; Power: 0.125 W
R110 R111 R123-R136 = CMP-1013-00623-1: as R10 on sheet 3 - Motor Drivers; Tolerance: 1 %; Power: 0.125 W; Technology: SMT
U14 U15 = CMP-0791-00060-1: Low Voltage 1.15 V to 5.5 V, 8-Channel Bidirectional Logic Level Translator, -40 to 85 degC, 20-pin SOP (RU-20), Tube; Manufacturer: Analog Devices; Bus Enable Time (typ): 1us; Mounting Technology: Surface Mount; DatasheetVersion: Rev. 0; ComponentLink1Description: Manufacturer URL; ComponentLink2URL: http://www.analog.com/static/imported-files/data_sheets/ADG3300.pdf; PackageVersion: Jan-03; ComponentLink2Description: Datasheet; PackageReference: RU-20; ComponentLink3URL: http://www.analog.com/static/imported-files/packages/364515793657813558433715854054607941441RU20.pdf; PackageDescription: 20-Pin Thin Shrink Small Outline Package, Body 6.5 x 4.4 mm, Pitch 0.65 mm; PartNumber: ADG3300BRUZ; Code_JEDEC: MO-153AC; ComponentLink3Description: Package Specification; ComponentLink1URL: http://www.analog.com/en/index.html
U17 = CMP-0133-00139-1: Simple, Miniature Single-Cell, Fully Integrated Li-Ion/Li-Polymer Charge Management Controller, 4.2V, 5-Pin SOT-23, Industrial Temperature, Tape and Reel; Code_IPC: SOT23-5; PackageDescription: 5-Lead Plastic Small Outline Transistor (OT) [SOT-23]; PackageVersion: revBB, Aug-2009; DatasheetVersion: revB, Sep-2007; PackageReference: SOT-23-OT5
U18 = TPS63020: pin to pad: EP>15

## Nets that join several sheets
+3V3: 1 - STM32 (43 pins), 5 - PWM Steering (8 pins), 2 - BLE (28 pins), 3 - Motor Drivers (20 pins), 4 - Connectors (15 pins)
GND: 1 - STM32 (47 pins), 5 - PWM Steering (8 pins), 2 - BLE (22 pins), 3 - Motor Drivers (98 pins), 4 - Connectors (30 pins)
VBATT: 3 - Motor Drivers (P7.2 P8.2), 4 - Connectors (10 pins)
VBUS: 1 - STM32 (J19.VBUS U16.5), 4 - Connectors (7 pins)
I2S2_CLK: 1 - STM32 (R71.1), 4 - Connectors (R130.2 U15.20)
I2S2_SD: 1 - STM32 (R62.2 R64.2), 4 - Connectors (R128.2 U15.17)
I2S2_WS: 1 - STM32 (R74.1), 4 - Connectors (R127.2 U15.16)
I2S3_CLK: 1 - STM32 (R37.2 R56.2), 4 - Connectors (R126.2 U15.15)
I2S3_SD: 1 - STM32 (R35.2 R36.2), 4 - Connectors (R124.2 U15.14)
NetQ2_3: 1 - STM32 (U1#1.46), 3 - Motor Drivers (Q2.3 R32.2)
NetQ4_3: 1 - STM32 (U1#1.45), 3 - Motor Drivers (Q4.3 R40.1)
NetQ5_3: 1 - STM32 (U1#1.43), 3 - Motor Drivers (Q5.3 R48.2)
NetQ7_3: 1 - STM32 (U1#1.44), 3 - Motor Drivers (Q7.3 R55.1)
NetQ9_3: 1 - STM32 (U1#1.41), 3 - Motor Drivers (Q9.3 R67.2)
NetQ10_3: 1 - STM32 (U1#1.42), 3 - Motor Drivers (Q10.3 R75.1)
NetQ11_3: 1 - STM32 (U1#1.39), 3 - Motor Drivers (Q11.3 R79.2)
NetQ12_3: 1 - STM32 (U1#1.40), 3 - Motor Drivers (Q12.3 R83.1)
NetQ13_1: 1 - STM32 (U1#1.5), 3 - Motor Drivers (Q13.1 R112.2)
NetR21_2: 1 - STM32 (U1#1.4), 2 - BLE (R21.2)
NetR22_2: 1 - STM32 (U1#1.3), 2 - BLE (R22.2)
NetR23_2: 1 - STM32 (U1#1.2), 2 - BLE (R23.2)
NetR24_2: 1 - STM32 (U1#1.88), 2 - BLE (R24.2)
NetR25_2: 1 - STM32 (U1#1.85), 2 - BLE (R25.2)
NetR26_2: 1 - STM32 (U1#1.84), 2 - BLE (R26.2)
NetR27_2: 1 - STM32 (U1#1.83), 2 - BLE (R27.2)
NetR28_2: 1 - STM32 (U1#1.1), 2 - BLE (R28.2)
NetR30_1: 1 - STM32 (U1#1.62), 2 - BLE (R30.1)
NetR38_2: 1 - STM32 (R38.2), 4 - Connectors (R125.2 U15.13)
NetR39_1: 1 - STM32 (U1#1.61), 2 - BLE (R39.1)
NetR46_1: 1 - STM32 (U1#1.60), 2 - BLE (R46.1)
NetR49_2: 1 - STM32 (R49.2), 4 - Connectors (R134.2 U14.18)
NetR53_2: 1 - STM32 (R53.2), 4 - Connectors (U14.20)
NetR57_1: 1 - STM32 (U1#1.59), 2 - BLE (R57.1)
NetR105_2: 1 - STM32 (R105.2), 4 - Connectors (R129.2 U15.18)
NetR111_2: 1 - STM32 (U1#1.16), 4 - Connectors (R111.2 U17.1)
NetU1#1_7: 1 - STM32 (U1#1.7), 3 - Motor Drivers (U8.10)
NetU1#1_8: 1 - STM32 (U1#1.8), 3 - Motor Drivers (U10.10)
NetU1#1_9: 1 - STM32 (U1#1.9), 3 - Motor Drivers (U12.10)
NetU1#1_23: 1 - STM32 (U1#1.23), 5 - PWM Steering (U5.10 U5.12)
NetU1#1_24: 1 - STM32 (U1#1.24), 5 - PWM Steering (U5.2 U5.4)
NetU1#1_25: 1 - STM32 (U1#1.25), 5 - PWM Steering (U6.10 U6.12)
NetU1#1_26: 1 - STM32 (U1#1.26), 5 - PWM Steering (U4.1 U5.13)
NetU1#1_31: 1 - STM32 (U1#1.31), 5 - PWM Steering (U7.2 U7.4)
NetU1#1_32: 1 - STM32 (U1#1.32), 5 - PWM Steering (U7.10 U7.12)
NetU1#1_33: 1 - STM32 (U1#1.33), 5 - PWM Steering (U4.3 U5.1)
NetU1#1_34: 1 - STM32 (U1#1.34), 5 - PWM Steering (U4.5 U6.13)
NetU1#1_35: 1 - STM32 (U1#1.35), 5 - PWM Steering (U6.2 U6.4)
NetU1#1_36: 1 - STM32 (U1#1.36), 4 - Connectors (U14.13)
NetU1#1_38: 1 - STM32 (U1#1.38), 5 - PWM Steering (U4.13 U6.1)
NetU1#1_47: 1 - STM32 (U1#1.47), 5 - PWM Steering (U4.11 U7.1)
NetU1#1_48: 1 - STM32 (U1#1.48), 5 - PWM Steering (U4.9 U7.13)
NetU1#1_63: 1 - STM32 (U1#1.63), 3 - Motor Drivers (U13.10)
NetU1#1_64: 1 - STM32 (U1#1.64), 3 - Motor Drivers (U11.10)
NetU1#1_65: 1 - STM32 (U1#1.65), 3 - Motor Drivers (U9.10)
NetU5_3: 5 - PWM Steering (U5.3), 3 - Motor Drivers (U10.2)
NetU5_6: 5 - PWM Steering (U5.6), 3 - Motor Drivers (U10.1)
NetU5_8: 5 - PWM Steering (U5.8), 3 - Motor Drivers (U8.1)
NetU5_11: 5 - PWM Steering (U5.11), 3 - Motor Drivers (U8.2)
NetU6_3: 5 - PWM Steering (U6.3), 3 - Motor Drivers (U13.2)
NetU6_6: 5 - PWM Steering (U6.6), 3 - Motor Drivers (U13.1)
NetU6_8: 5 - PWM Steering (U6.8), 3 - Motor Drivers (U12.1)
NetU6_11: 5 - PWM Steering (U6.11), 3 - Motor Drivers (U12.2)
NetU7_3: 5 - PWM Steering (U7.3), 3 - Motor Drivers (U9.2)
NetU7_6: 5 - PWM Steering (U7.6), 3 - Motor Drivers (U9.1)
NetU7_8: 5 - PWM Steering (U7.8), 3 - Motor Drivers (U11.1)
NetU7_11: 5 - PWM Steering (U7.11), 3 - Motor Drivers (U11.2)
RST#: 1 - STM32 (C7.1 J12.5 SW1.1 U1#1.14), 4 - Connectors (R131.2 U14.12)
SPI2_CS#: 1 - STM32 (R72.1), 4 - Connectors (R132.2 U14.14)
SPI2_MISO: 1 - STM32 (R63.2), 4 - Connectors (U14.17)
SPI2_MOSI: 1 - STM32 (R65.2), 4 - Connectors (R135.2 U14.16)
SPI2_SCK: 1 - STM32 (R73.1), 4 - Connectors (R133.2 U14.15)
USART3_RX: 1 - STM32 (U1#1.56), 2 - BLE (R78.2)
USART3_TX: 1 - STM32 (U1#1.55), 2 - BLE (R81.2)